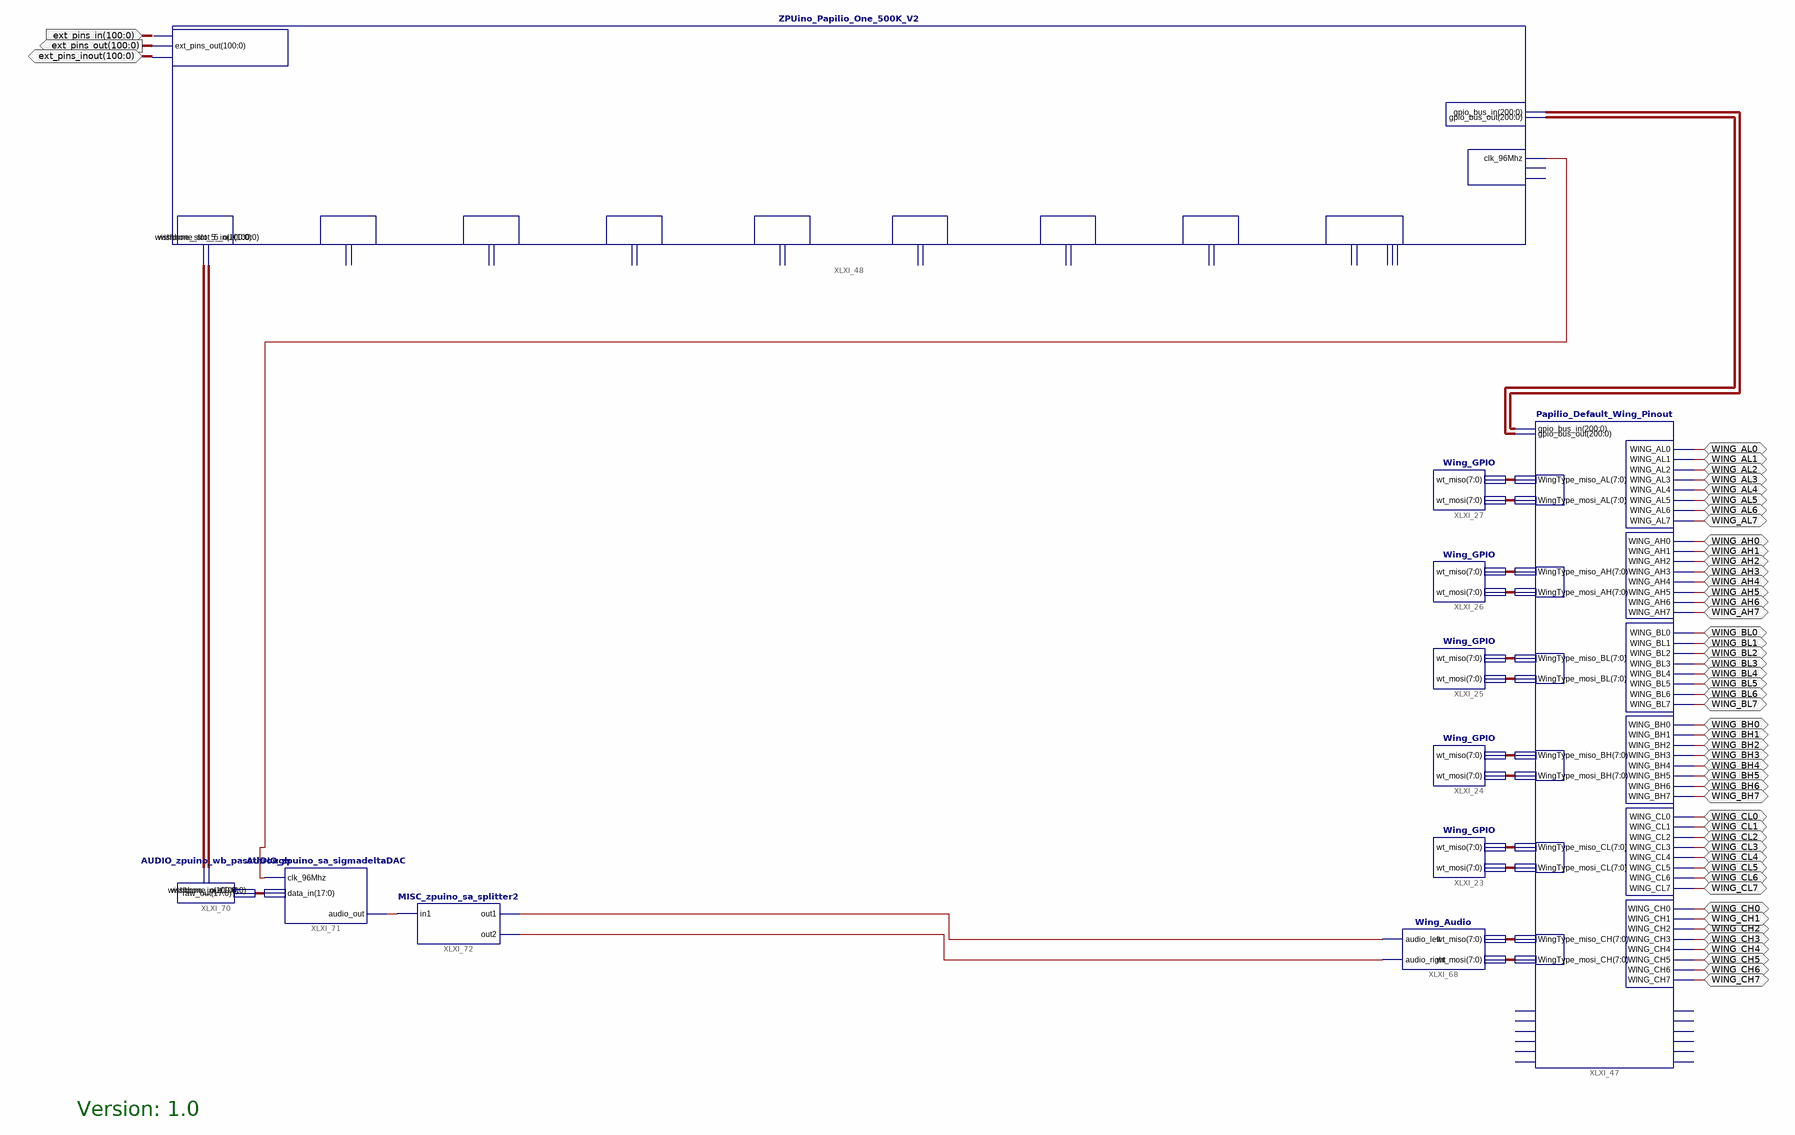
[diagram p0: schematic sheet 1]
// Xilinx ISE schematic Papilio_One_500K.sch (spartan3e) as structural Verilog: 11 symbols, 51 ports
module Papilio_One_500K (
  input  [100:0] ext_pins_in,
  inout  WING_AL0,
  inout  WING_AL1,
  inout  WING_AL2,
  inout  WING_AL3,
  inout  WING_AL4,
  inout  WING_AL5,
  inout  WING_AL6,
  inout  WING_AL7,
  inout  WING_AH0,
  inout  WING_AH1,
  inout  WING_AH2,
  inout  WING_AH3,
  inout  WING_AH4,
  inout  WING_AH5,
  inout  WING_AH6,
  inout  WING_AH7,
  inout  WING_BL0,
  inout  WING_BL1,
  inout  WING_BL2,
  inout  WING_BL3,
  inout  WING_BL4,
  inout  WING_BL5,
  inout  WING_BL6,
  inout  WING_BL7,
  inout  WING_BH0,
  inout  WING_BH1,
  inout  WING_BH2,
  inout  WING_BH3,
  inout  WING_BH4,
  inout  WING_BH5,
  inout  WING_BH6,
  inout  WING_BH7,
  inout  WING_CL0,
  inout  WING_CL1,
  inout  WING_CL2,
  inout  WING_CL3,
  inout  WING_CL4,
  inout  WING_CL5,
  inout  WING_CL6,
  inout  WING_CL7,
  inout  WING_CH2,
  inout  WING_CH3,
  inout  WING_CH4,
  inout  WING_CH5,
  inout  WING_CH6,
  inout  WING_CH7,
  inout  [100:0] ext_pins_inout,
  inout  WING_CH0,
  inout  WING_CH1,
  output [100:0] ext_pins_out
);

  wire XLXN_553, XLXN_554, XLXN_555, XLXN_556;
  wire [7:0] XLXN_532, XLXN_533, XLXN_534, XLXN_535, XLXN_536, XLXN_537, XLXN_538, XLXN_539, XLXN_540,
       XLXN_541, XLXN_542, XLXN_543;
  wire [17:0] XLXN_552;
  wire [100:0] XLXN_550, XLXN_551;
  wire [200:0] XLXN_408, XLXN_409;

  Papilio_Default_Wing_Pinout XLXI_47 (
    .WING_AH0(WING_AH0), .WING_AH1(WING_AH1), .WING_AH2(WING_AH2), .WING_AH3(WING_AH3), .WING_AH4(WING_AH4),
    .WING_AH5(WING_AH5), .WING_AH6(WING_AH6), .WING_AH7(WING_AH7), .WING_AL0(WING_AL0), .WING_AL1(WING_AL1),
    .WING_AL2(WING_AL2), .WING_AL3(WING_AL3), .WING_AL4(WING_AL4), .WING_AL5(WING_AL5), .WING_AL6(WING_AL6),
    .WING_AL7(WING_AL7), .WING_BH0(WING_BH0), .WING_BH1(WING_BH1), .WING_BH2(WING_BH2), .WING_BH3(WING_BH3),
    .WING_BH4(WING_BH4), .WING_BH5(WING_BH5), .WING_BH6(WING_BH6), .WING_BH7(WING_BH7), .WING_BL0(WING_BL0),
    .WING_BL1(WING_BL1), .WING_BL2(WING_BL2), .WING_BL3(WING_BL3), .WING_BL4(WING_BL4), .WING_BL5(WING_BL5),
    .WING_BL6(WING_BL6), .WING_BL7(WING_BL7), .WING_CL0(WING_CL0), .WING_CL1(WING_CL1), .WING_CL2(WING_CL2),
    .WING_CL3(WING_CL3), .WING_CL4(WING_CL4), .WING_CL5(WING_CL5), .WING_CL6(WING_CL6), .WING_CL7(WING_CL7),
    .WING_CH0(WING_CH0), .WING_CH1(WING_CH1), .WING_CH2(WING_CH2), .WING_CH3(WING_CH3), .WING_CH4(WING_CH4),
    .WING_CH5(WING_CH5), .WING_CH6(WING_CH6), .WING_CH7(WING_CH7), .gpio_bus_out(XLXN_408),
    .gpio_bus_in(XLXN_409), .WingType_miso_BH(XLXN_538), .WingType_miso_BL(XLXN_536),
    .WingType_miso_AH(XLXN_534), .WingType_mosi_BL(XLXN_537), .WingType_mosi_BH(XLXN_539),
    .WingType_mosi_CL(XLXN_541), .WingType_mosi_AH(XLXN_535), .WingType_miso_CL(XLXN_540),
    .WingType_miso_CH(XLXN_542), .WingType_mosi_CH(XLXN_543), .WingType_mosi_AL(XLXN_533),
    .WingType_miso_AL(XLXN_532));  // open: Flex_Pin_out_0, Flex_Pin_out_1, Flex_Pin_out_2, Flex_Pin_out_3, Flex_Pin_out_4, Flex_Pin_out_5, Flex_Pin_in_0, Flex_Pin_in_1, Flex_Pin_in_2, Flex_Pin_in_3, Flex_Pin_in_4, Flex_Pin_in_5
  ZPUino_Papilio_One_500K_V2 XLXI_48 (
    .clk_96Mhz(XLXN_554), .ext_pins_in(ext_pins_in), .ext_pins_out(ext_pins_out),
    .ext_pins_inout(ext_pins_inout), .gpio_bus_out(XLXN_408), .gpio_bus_in(XLXN_409),
    .wishbone_slot_5_out(XLXN_551), .wishbone_slot_5_in(XLXN_550));  // open: clk_1Mhz, clk_osc_32Mhz, wishbone_slot_6_in, wishbone_slot_6_out, wishbone_slot_8_in, wishbone_slot_8_out, wishbone_slot_9_in, wishbone_slot_9_out, wishbone_slot_10_in, wishbone_slot_10_out, wishbone_slot_11_in, wishbone_slot_11_out, wishbone_slot_12_in, wishbone_slot_12_out, wishbone_slot_13_in, wishbone_slot_13_out, wishbone_slot_14_in, wishbone_slot_14_out, wishbone_slot_video_in, wishbone_slot_video_out, vgaclkout
  Wing_GPIO XLXI_27 (.wt_miso(XLXN_532), .wt_mosi(XLXN_533));
  Wing_GPIO XLXI_26 (.wt_miso(XLXN_534), .wt_mosi(XLXN_535));
  Wing_GPIO XLXI_25 (.wt_miso(XLXN_536), .wt_mosi(XLXN_537));
  Wing_GPIO XLXI_24 (.wt_miso(XLXN_538), .wt_mosi(XLXN_539));
  Wing_GPIO XLXI_23 (.wt_miso(XLXN_540), .wt_mosi(XLXN_541));
  Wing_Audio XLXI_68 (.audio_left(XLXN_555), .audio_right(XLXN_556), .wt_miso(XLXN_542), .wt_mosi(XLXN_543));
  AUDIO_zpuino_wb_passthrough XLXI_70 (.raw_out(XLXN_552), .wishbone_in(XLXN_550), .wishbone_out(XLXN_551));
  AUDIO_zpuino_sa_sigmadeltaDAC XLXI_71 (.data_in(XLXN_552), .audio_out(XLXN_553), .clk_96Mhz(XLXN_554));
  MISC_zpuino_sa_splitter2 XLXI_72 (.in1(XLXN_553), .out1(XLXN_555), .out2(XLXN_556));

  // Notes on the sheet:
  //   Version: 1.0
endmodule
